# EAGLE schematic Codeshelf-0009.v03 (EAGLE 6.5.0)
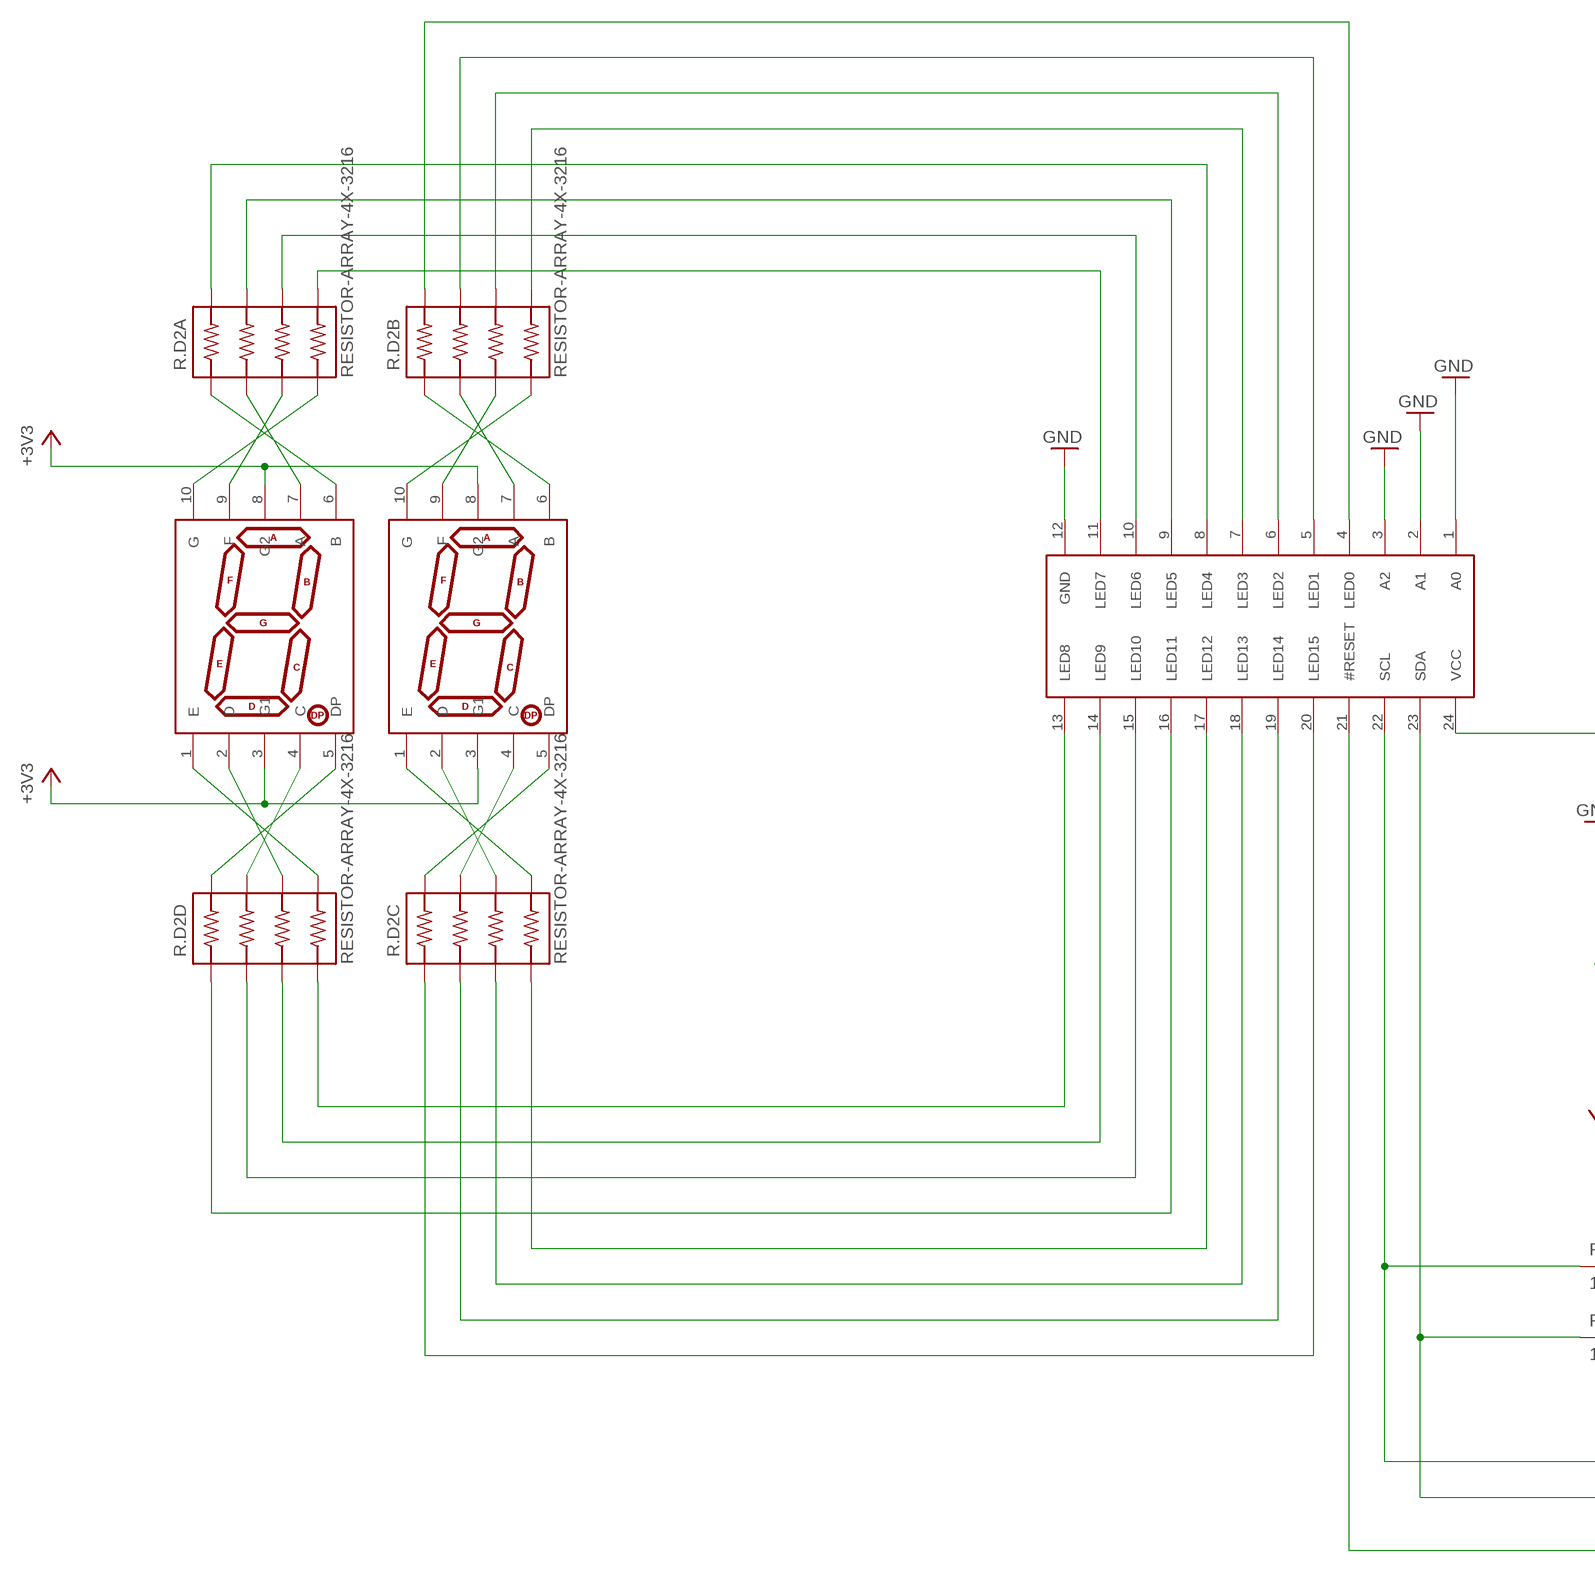
[diagram p0: schematic, sheet 1, part 1 of 2]
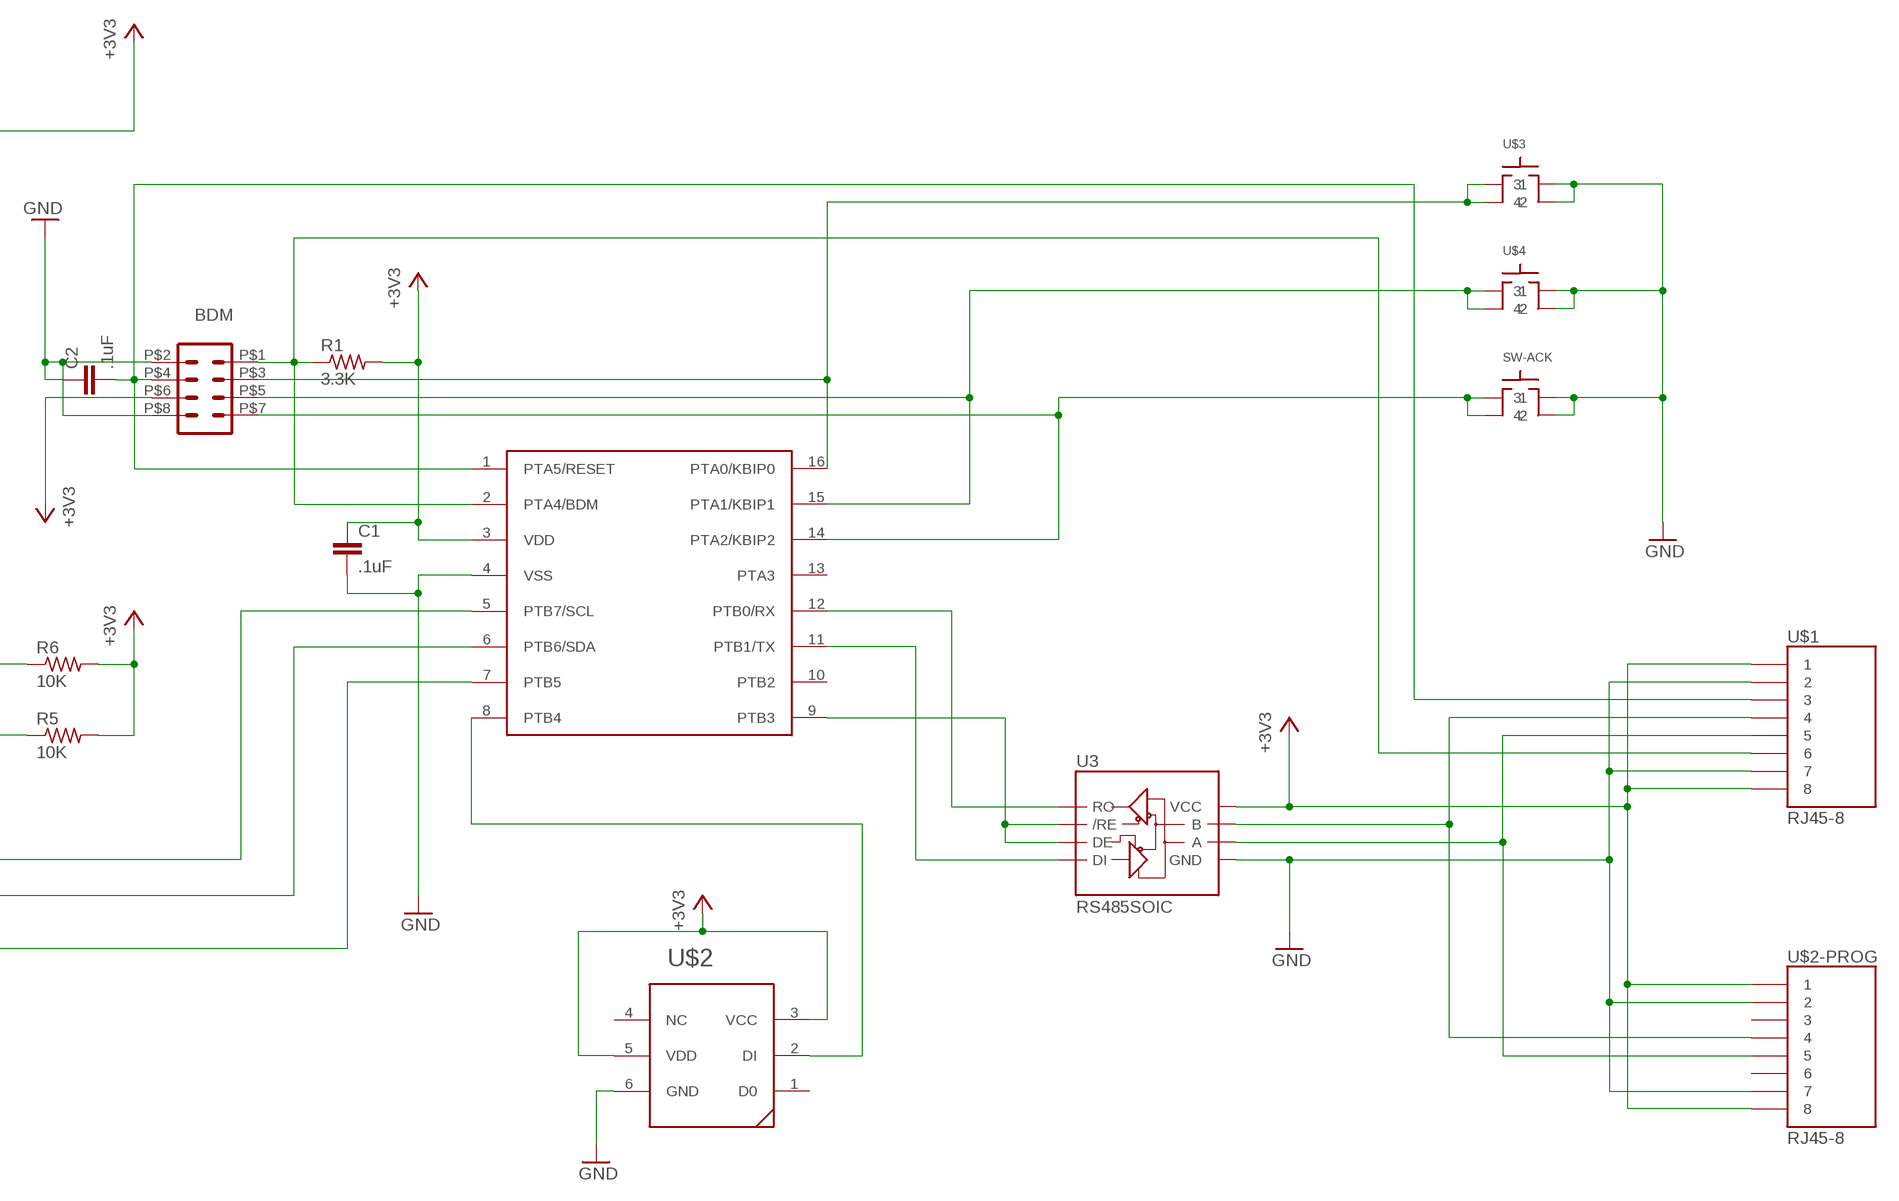
[diagram p1: schematic, sheet 1, part 2 of 2]

## Parts
BDM  TP2X4SMD  [SMD4X2]
C1  .1uF  RF-C0402  [C0402]
C2  .1uF  RF-C0402  [C0402]
LED1  7SEGMENT-1DIGITSMD  [7SEGMENT-1DIG-.40-SMD]
LED2  7SEGMENT-1DIGITSMD  [7SEGMENT-1DIG-.40-SMD]
R1  3.3K  RF-R0402  [RF-R0402]
R5  10K  RF-R0402  [RF-R0402]
R6  10K  RF-R0402  [RF-R0402]
R.D2A  RESISTOR-ARRAY-4X-3216  [3216-4X]
R.D2B  RESISTOR-ARRAY-4X-3216  [3216-4X]
R.D2C  RESISTOR-ARRAY-4X-3216  [3216-4X]
R.D2D  RESISTOR-ARRAY-4X-3216  [3216-4X]
SW-ACK  SWITCH-TACTILE-320.03E11  [SWITCH-TACTILE-320.03E11]
U1  MC9S08QG-DT  [TSSOP16]
U3  RS485SOIC  [SO08]
U4  CAT9552  [TSSOP24]
U$1  RJ45-8  [MOLEX-0955016649]
U$2  WS2812  [PLCC-6]
U$2-PROG  RJ45-8  [MOLEX-0955016649]
U$3  SWITCH-TACTILE  [ESWITCH-TL3301PF]
U$4  SWITCH-TACTILE  [ESWITCH-TL3301PF]

## Nets
485_N: U3.7(B) U$1.P$4 U$2-PROG.P$4
485_P: U3.6(A) U$1.P$5 U$2-PROG.P$5
+3V3 [+3V3]: BDM.P$6 C1.1 LED1.3(G1) LED1.8(G2) LED2.3(G1) LED2.8(G2) R1.2 R5.2 R6.2 U1.3(VDD) U3.8(VCC) U4.24(VCC) U$1.P$1 U$1.P$8 U$2-PROG.P$1 U$2-PROG.P$8 U$2.3(VCC) U$2.5(VDD)
GND [GND]: BDM.P$2 BDM.P$8 C1.2 C2.1 SW-ACK.P$3 SW-ACK.P$4 U1.4(VSS) U3.5(GND) U4.1(A0) U4.2(A1) U4.3(A2) U4.12(GND) U$1.P$2 U$1.P$7 U$2-PROG.P$2 U$2-PROG.P$7 U$2.6(GND) U$3.3 U$3.4 U$4.3 U$4.4
N$2: R.D2A.5(4B) U4.11(LED7)
N$3: U1.8(PTB4) U$2.2(DI)
N$8: R.D2A.6(3B) U4.10(LED6)
N$9: BDM.P$1 R1.1 U1.2(PTA4/BDM) U$1.P$6
N$10: R.D2A.7(2B) U4.9(LED5)
N$11: R.D2A.8(1B) U4.8(LED4)
N$12: R.D2B.5(4B) U4.7(LED3)
N$13: R.D2B.6(3B) U4.6(LED2)
N$14: R.D2B.7(2B) U4.5(LED1)
N$15: R.D2B.8(1B) U4.4(LED0)
N$16: LED2.6(B) R.D2A.1(1A)
N$17: LED2.7(A) R.D2A.2(2A)
N$18: LED2.9(F) R.D2A.3(3A)
N$19: U1.9(PTB3) U3.2(/RE) U3.3(DE)
N$20: LED2.10(G) R.D2A.4(4A)
N$21: LED2.5(DP) R.D2D.8(1B)
N$22: LED2.4(C) R.D2D.7(2B)
N$23: BDM.P$4 C2.2 U1.1(PTA5/RESET) U$1.P$3
N$24: LED2.2(D) R.D2D.6(3B)
N$25: LED2.1(E) R.D2D.5(4B)
N$26: LED1.6(B) R.D2B.1(1A)
N$27: LED1.7(A) R.D2B.2(2A)
N$28: LED1.9(F) R.D2B.3(3A)
N$29: LED1.10(G) R.D2B.4(4A)
N$30: LED1.5(DP) R.D2C.8(1B)
N$31: R.D2D.4(4A) U4.13(LED8)
N$32: R.D2D.3(3A) U4.14(LED9)
N$33: R.D2D.2(2A) U4.15(LED10)
N$34: R.D2D.1(1A) U4.16(LED11)
N$35: R.D2C.4(4A) U4.17(LED12)
N$36: R.D2C.3(3A) U4.18(LED13)
N$37: R.D2C.2(2A) U4.19(LED14)
N$38: R.D2C.1(1A) U4.20(LED15)
N$39: LED1.4(C) R.D2C.7(2B)
N$40: LED1.2(D) R.D2C.6(3B)
N$41: LED1.1(E) R.D2C.5(4B)
N$42: BDM.P$7 SW-ACK.P$1 SW-ACK.P$2 U1.14(PTA2/KBIP2)
N$43: BDM.P$5 U1.15(PTA1/KBIP1) U$4.1 U$4.2
N$45: BDM.P$3 U1.16(PTA0/KBIP0) U$3.1 U$3.2
RESET: U1.7(PTB5) U4.21(#RESET)
RX: U1.12(PTB0/RX) U3.1(RO)
SLA: R5.1 U1.6(PTB6/SDA) U4.23(SDA)
SLC: R6.1 U1.5(PTB7/SCL) U4.22(SCL)
TX: U1.11(PTB1/TX) U3.4(DI)
Unconnected: U1.10(PTB2) U1.13(PTA3) U$2-PROG.P$3 U$2-PROG.P$6 U$2.1(D0) U$2.4(NC)

## Library data of the parts
BDM = GW-devices:TP2X4SMD
C1 C2 = GW-devices:RF-C: RF capacitor pads for FSL reference design; MFGN: Murata; MFGP: GRM033R61A104KE15D; PRICE: 0.02
LED1 LED2 = GW-devices:7SEGMENT-1DIGIT
R1 = GW-devices:RF-R: RF resistor pads for FSL reference design; MFGN: Panasonic; MFGP: ERJ-2GEJ332X; PRICE: 0.02
R5 R6 = GW-devices:RF-R: RF resistor pads for FSL reference design; MFGN: Panasonic; MFGP: ERJ-2GEJ103X; PRICE: 0.02
R.D2A R.D2B R.D2C R.D2D = GW-devices:RESISTOR-ARRAY-4X; MFGN: Yageo; MFGP: YC164-JR-07120RL; PRICE: 0.006
SW-ACK = GW-devices:SWITCH-TACTILE; MFGN: ESwitch; MFGP: 320.03E11
U1 = GW-devices:MC9S08QG; MFGN: Freescale; MFGP: MC9S08QG8CDTER; PRICE: 1.73
U3 = SparkFun:RS485; MFGN: TI; MFGP: SN65HVD1781DR; PRICE: 4.29
U4 = GW-devices:CAT9552; MFGN: On Semiconductor; MFGP: CAT9552YI-T2; PRICE: 1.28
U$1 U$2-PROG = GW-devices:RJ45-8: RJ45 Jack MFG part number 54602-908lf
U$2 = GW-devices:WS2812
U$3 U$4 = GW-devices:SWITCH-TACTILE